# Altium schematic sheet MouseSensor.SchDoc
size Letter; CompanyName: Ploopy Corporation; Organization: Ploopy Corporation; Address1: 137-1140 Burnhamthorpe Road W; Address2: Mississauga; Address3: Ontario; Address4: Canada L5C 0A3; DocumentNumber: 7; Revision: R1.001; SheetNumber: 7; SheetTotal: 8
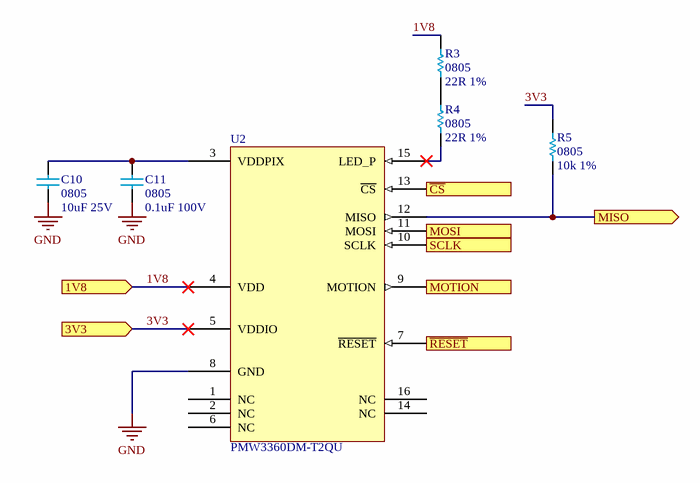
[diagram p0: MouseSensor.SchDoc]

## Parts
C10  0805  value 10uF 25V  [0805]
C11  0805  value 0.1uF 100V  [0805]
R3  0805  value 22R 1%  [0805]
R4  0805  value 22R 1%  [0805]
R5  0805  value 10k 1%  [0805]
U2  PMW3360DM-T2QU  [PMW3360DM-T2QU]

## Ports
1V8 (in), 3V3 (in), MISO (out), MOSI (in), MOTION (out), SCLK (in), ~{CS} (in), ~{RESET} (in)

## Nets
GND: C10.1 C11.1 U2.8(GND)
1V8: R3.2 U2.4(VDD) ; port 1V8
3V3: R5.2 U2.5(VDDIO) ; port 3V3
~{CS}: U2.13(~{CS}) ; port ~{CS}
MISO: R5.1 U2.12(MISO) ; port MISO
MOSI: U2.11(MOSI) ; port MOSI
MOTION: U2.9(MOTION) ; port MOTION
~{RESET}: U2.7(~{RESET}) ; port ~{RESET}
SCLK: U2.10(SCLK) ; port SCLK
NetC10_2: C10.2 C11.2 U2.3(VDDPIX)
NetR3_1: R3.1 R4.2
NetR4_1: R4.1 U2.15(LED_P)

Not connected (* = marked no-connect by the designer): U2 1(NC) 2(NC) 6(NC) 14(NC) 16(NC)

## Notes on the sheet
- Copyright Ploopy Corporation 2021
- Licensed under the CERN-OHL-S v2
- http://ohwr.org/cernohl
- Title:
- PCB:
- Version:
- Ploopy Corporation
- Mississauga ON L5C 0A3
- 137-1140 Burnhamthorpe Road W
- Date:
- Time:
- Sheet
- of
- Canada

## Library data of the parts
C10 = Cap 10uF 25V: 0805, X5R or better; PNP-Nzl: 2; PNP-dx: 0; PNP-X: 2.00; PNP-Y: 1.25; PNP-Lv: 1; PNP-TS: 70; PNP-Type: chi; PNP-FeedType: Tape; PNP-TapeWidth: 8; PNP-dy: 0; PNP-Pt: 0; PNP-W: 0; PNP-Thk: 1.25; PNP-Level: 1; PNP-Voff: 0; PNP-PlacePriority: 1; PNP-A: 0; PNP-TapeIndex: 1; Supplier 1: Mouser; Supplier Part Number 1: 81-GRM21BR61E106KA3L; Supplier 2: Digi-Key; Supplier Part Number 2: 490-5523-1-ND; PNP-da: 0
C11 = Cap 0.1uF 100V: 0805, X5R or better; PNP-Nzl: 2; PNP-dx: 0; PNP-Level: 1; PNP-Thk: 1.05; PNP-TS: 70; PNP-Type: chi; PNP-X: 2.00; PNP-Y: 1.25; PNP-FeedType: Tape; PNP-TapeWidth: 8; Supplier 1: Digi-Key; Supplier Part Number 1: 1276-6840-2-ND; PNP-dy: 0; PNP-Lv: 1; PNP-Pt: 0; PNP-Voff: 0; PNP-W: 0; PNP-A: 0; PNP-PlacePriority: 1; PNP-TapeIndex: 1; PNP-da: 0
R3 R4 = Res 22R 1% 0805: Chip resistor; PNP-Nzl: 2; PNP-dx: 0; PNP-X: 2.00; PNP-Y: 1.25; PNP-Thk: 0.55; PNP-Lv: 1; PNP-TS: 70; PNP-Type: chi; PNP-FeedType: Tape; PNP-TapeWidth: 8; PNP-dy: 0; PNP-Pt: 0; PNP-W: 0; PNP-Level: 1; PNP-Voff: 0; PNP-PlacePriority: 1; PNP-A: 0; PNP-TapeIndex: 1; PNP-da: 0; Supplier 1: Digi-Key; Supplier 2: Arrow; Supplier Part Number 1: RMCF0805FT22R0CT-ND; Supplier Part Number 2: RMCF0805FT22R0
R5 = Res 10k 1% 0805: Chip resistor; PNP-Nzl: 2; PNP-dx: 0; PNP-X: 2.00; PNP-Y: 1.25; PNP-Thk: 0.55; PNP-Lv: 1; PNP-TS: 70; PNP-Type: chi; PNP-FeedType: Tape; PNP-TapeWidth: 8; Supplier 1: Digi-Key; Supplier Part Number 1: RMCF0805FT10K0TR-ND; PNP-dy: 0; PNP-Pt: 0; PNP-W: 0; PNP-Level: 1; PNP-Voff: 0; PNP-PlacePriority: 1; PNP-A: 0; PNP-TapeIndex: 1; PNP-da: 0
U2 = PMW3360DM-T2QU: Optical Gaming Navigation Sensor; PNP-Nzl: 4; PNP-dx: 0; PNP-X: 4.9; PNP-Y: 3.9; PNP-W: 0.1; PNP-Thk: 1.45; PNP-Lv: 26; PNP-TS: 70; PNP-Level: 1.3; PNP-Type: QFP; PNP-FeedType: Tape; PNP-TapeWidth: 12; PNP-PlacePriority: 3; PNP-TapeIndex: 2; PNP-dy: 0; PNP-A: 0; PNP-Pt: 0; PNP-Voff: 0; PNP-da: 0